# EAGLE design dual.seq.v1.0.1.main (EAGLE 7.7.0)
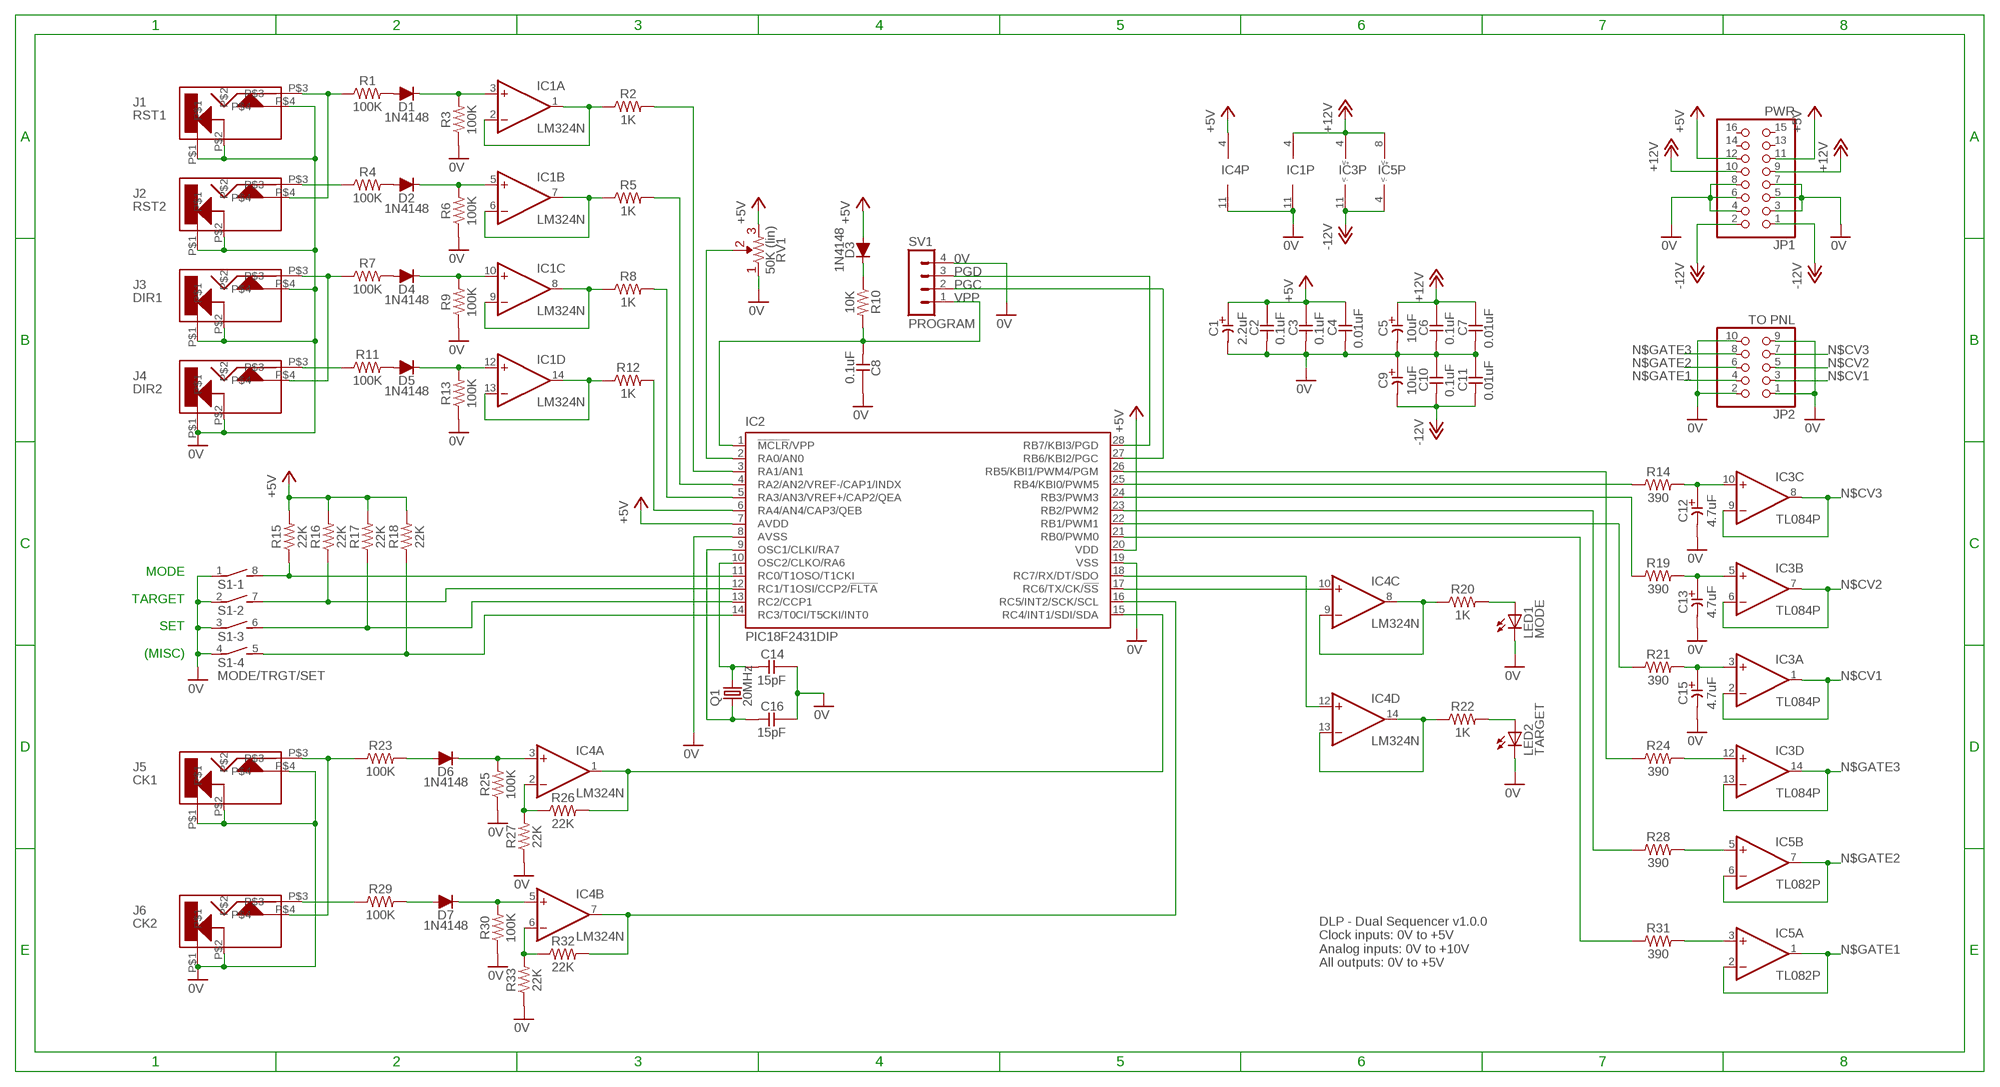
[diagram p0: schematic, sheet 1]

## Parts
C1  2.2uF  CE-USE2-5  [E2-5]
C2  0.1uF  CC-US025-024X044  [C025-024X044]
C3  0.1uF  CC-US025-024X044  [C025-024X044]
C4  0.01uF  CC-US025-024X044  [C025-024X044]
C5  10uF  CE-USE2-5  [E2-5]
C6  0.1uF  CC-US025-024X044  [C025-024X044]
C7  0.01uF  CC-US025-024X044  [C025-024X044]
C8  0.1uF  CC-US025-024X044  [C025-024X044]
C9  10uF  CE-USE2-5  [E2-5]
C10  0.1uF  CC-US025-024X044  [C025-024X044]
C11  0.01uF  CC-US025-024X044  [C025-024X044]
C12  4.7uF  CE-USE2-5  [E2-5]
C13  4.7uF  CE-USE2-5  [E2-5]
C14  15pF  CC-US025-024X044  [C025-024X044]
C15  4.7uF  CE-USE2-5  [E2-5]
C16  15pF  CC-US025-024X044  [C025-024X044]
D1  1N4148  [DO34-5]
D2  1N4148  [DO34-5]
D3  1N4148  [DO34-5]
D4  1N4148  [DO34-5]
D5  1N4148  [DO34-5]
D6  1N4148  [DO34-5]
D7  1N4148  [DO34-5]
IC1  LM324N  [DIL14]
IC2  PIC18F2431DIP  [DIL28-3]
IC3  TL084P  [DIL14]
IC4  LM324N  [DIL14]
IC5  TL082P  [DIL08]
J1  RST1  CL1384  [CL1384]
J2  RST2  CL1384  [CL1384]
J3  DIR1  CL1384  [CL1384]
J4  DIR2  CL1384  [CL1384]
J5  CK1  CL1384  [CL1384]
J6  CK2  CL1384  [CL1384]
JP1  PWR  PINHD-2X8  [2X08]
JP2  TO PNL  PINHD-2X5  [2X05]
LED1  MODE  LED3MM  [LED3MM]
LED2  TARGET  LED3MM  [LED3MM]
Q1  20MHz  CRYSTALHC49S  [HC49/S]
R1  100K  R  [0207/7]
R2  1K  R  [0207/7]
R3  100K  R  [0207/7]
R4  100K  R  [0207/7]
R5  1K  R  [0207/7]
R6  100K  R  [0207/7]
R7  100K  R  [0207/7]
R8  1K  R  [0207/7]
R9  100K  R  [0207/7]
R10  10K  R  [0207/7]
R11  100K  R  [0207/7]
R12  1K  R  [0207/7]
R13  100K  R  [0207/7]
R14  390  R  [0207/7]
R15  22K  R  [0207/7]
R16  22K  R  [0207/7]
R17  22K  R  [0207/7]
R18  22K  R  [0207/7]
R19  390  R  [0207/7]
R20  1K  R  [0207/7]
R21  390  R  [0207/7]
R22  1K  R  [0207/7]
R23  100K  R  [0207/7]
R24  390  R  [0207/7]
R25  100K  R  [0207/7]
R26  22K  R  [0207/7]
R27  22K  R  [0207/7]
R28  390  R  [0207/7]
R29  100K  R  [0207/7]
R30  100K  R  [0207/7]
R31  390  R  [0207/7]
R32  22K  R  [0207/7]
R33  22K  R  [0207/7]
RV1  50K (lin)  R-VAR  [R-VAR]
S1  MODE/TRGT/SET  DIP04S  [DIP04S]
SV1  PROGRAM  MA04-1  [MA04-1]

## Nets
0V [PWR]: C1.- C2.2 C3.2 C4.2 C5.- C6.2 C7.2 C8.1 C9.+ C10.1 C11.1 C12.- C13.- C14.1 C15.- C16.1 IC1.11(P:V-) IC2.8(AVSS) IC2.19(VSS) IC4.11(P:V-) J1.P$1 J1.P$2 J1.P$4 J2.P$1 J2.P$2 J3.P$1 J3.P$2 J3.P$4 J4.P$1 J4.P$2 J5.P$1 J5.P$2 J5.P$4 J6.P$1 J6.P$2 JP1.3 JP1.4 JP1.5 JP1.6 JP1.7 JP1.8 JP2.1 JP2.2 JP2.9 JP2.10 LED1.K(C) LED2.K(C) R3.1 R6.1 R9.1 R13.1 R25.1 R27.1 R30.1 R33.1 RV1.R1 S1.1 S1.2 S1.3 S1.4 SV1.4
+5V [PWR]: C1.+ C2.1 C3.1 C4.1 D3.A IC2.7(AVDD) IC2.20(VDD) IC4.4(P:V+) JP1.11 JP1.12 R15.2 R16.2 R17.2 R18.2 RV1.R2
+12V [PWR]: C5.+ C6.1 C7.1 IC1.4(P:V+) IC3.4(P:V+) IC5.8(P:V+) JP1.9 JP1.10
-12V [PWR]: C9.- C10.2 C11.2 IC3.11(P:V-) IC5.4(P:V-) JP1.1 JP1.2
CV3: C12.+ IC3.10(C:+IN) R14.2
N$1: D3.C R10.1
N$2: IC5.3(A:+IN) R31.2
N$3: IC5.5(B:+IN) R28.2
N$4: IC3.12(D:+IN) R24.2
N$5: C15.+ IC3.3(A:+IN) R21.2
N$6: C14.2 IC2.10(OSC2/CLKO/RA6) Q1.2
N$7: C13.+ IC3.5(B:+IN) R19.2
N$8: IC2.26(RB5/KBI1/PWM4/PGM) R24.1
N$9: IC2.23(RB2/PWM2) R28.1
N$10: IC2.21(RB0/PWM0) R31.1
N$11: D5.A R11.2
N$12: IC2.2(RA0/AN0) RV1.VAR
N$13: J1.P$3 J2.P$4 R1.1
N$14: IC2.3(RA1/AN1) R2.2
N$15: D2.A R4.2
N$16: IC2.25(RB4/KBI0/PWM5) R14.1
N$17: IC2.24(RB3/PWM3) R19.1
N$18: IC2.22(RB1/PWM1) R21.1
N$19: IC2.15(RC4/INT1/SDI/SDA) IC4.1(A:OUT) R26.2
N$20: IC2.11(RC0/T1OSO/T1CKI) R15.1 S1.8
N$21: IC2.16(RC5/INT2/SCK/SCL) IC4.7(B:OUT) R32.2
N$22: D5.C IC1.12(D:+IN) R13.2
N$23: J3.P$3 J4.P$4 R7.1
N$24: D4.C IC1.10(C:+IN) R9.2
N$25: IC2.4(RA2/AN2/VREF-/CAP1/INDX) R5.2
N$26: IC2.5(RA3/AN3/VREF+/CAP2/QEA) R8.2
N$27: C16.2 IC2.9(OSC1/CLKI/RA7) Q1.1
N$28: IC2.12(RC1/T1OSI/CCP2/!FLTA) R16.1 S1.7
N$29: IC2.13(RC2/CCP1) R17.1 S1.6
N$30: J5.P$3 J6.P$4 R23.1
N$31: IC2.6(RA4/AN4/CAP3/QEB) R12.2
N$32: D6.C IC4.3(A:+IN) R25.2
N$33: D2.C IC1.5(B:+IN) R6.2
N$34: IC4.13(D:-IN) IC4.14(D:OUT) R22.1
N$35: IC4.8(C:OUT) IC4.9(C:-IN) R20.1
N$36: IC2.17(RC6/TX/CK/!SS) IC4.10(C:+IN)
N$37: IC2.18(RC7/RX/DT/SDO) IC4.12(D:+IN)
N$38: LED1.A R20.2
N$39: LED2.A R22.2
N$40: D1.C IC1.3(A:+IN) R3.2
N$41: J6.P$3 R29.1
N$42: D7.C IC4.5(B:+IN) R30.2
N$43: IC2.14(RC3/T0CI/T5CKI/INT0) R18.1 S1.5
N$44: D6.A R23.2
N$45: D7.A R29.2
N$46: D4.A R7.2
N$47: D1.A R1.2
N$48: J4.P$3 R11.1
N$49: J2.P$3 R4.1
N$50: IC1.1(A:OUT) IC1.2(A:-IN) R2.1
N$51: IC1.6(B:-IN) IC1.7(B:OUT) R5.1
N$52: IC1.8(C:OUT) IC1.9(C:-IN) R8.1
N$53: IC1.13(D:-IN) IC1.14(D:OUT) R12.1
N$54: IC4.2(A:-IN) R26.1 R27.2
N$55: IC4.6(B:-IN) R32.1 R33.2
N$CV1: IC3.1(A:OUT) IC3.2(A:-IN) JP2.3
N$CV2: IC3.6(B:-IN) IC3.7(B:OUT) JP2.5
N$CV3: IC3.8(C:OUT) IC3.9(C:-IN) JP2.7
N$GATE1: IC5.1(A:OUT) IC5.2(A:-IN) JP2.4
N$GATE2: IC5.6(B:-IN) IC5.7(B:OUT) JP2.6
N$GATE3: IC3.13(D:-IN) IC3.14(D:OUT) JP2.8
PGC: IC2.27(RB6/KBI2/PGC) SV1.2
PGD: IC2.28(RB7/KBI3/PGD) SV1.3
VPP: C8.2 IC2.1(!MCLR!/VPP) R10.2 SV1.1
Unconnected: JP1.13 JP1.14 JP1.15 JP1.16

## Notes on the sheet
- MODE
  
  TARGET
  
  SET
  
  (MISC)
- DLP - Dual Sequencer v1.0.0
  Clock inputs: 0V to +5V
  Analog inputs: 0V to +10V
  All outputs: 0V to +5V

## Library data of the parts
C1 C5 C9 C12 C13 C15 = _common:CE-US: ELECTROLYTIC CAPACITOR, US symbol
C2-C4 C6-C8 C10 C11 C14 C16 = _common:CC-US: CAPACITOR, US symbol
D1-D7 = _common:1N4148: DIODE high speed (Philips)
IC1 IC4 = linear:LM324: OP AMP
IC2 = _common:PIC18F2*31: USB Microcontrollers with nanoWatt Technology High-Performance, Enhanced Flash, 28-Pin, Source: http://ww1.microchip.com/downloads/en/devicedoc/39616d.pdf; MF: MICROCHIP; MPN: PIC18F2431-I/SP
IC3 = _common:TL084: OP AMP
IC5 = _common:TL082: OP AMP
J1-J6 = jacks:CL1384
JP1 = pinhead:PINHD-2X8: PIN HEADER
JP2 = pinhead:PINHD-2X5: PIN HEADER
LED1 LED2 = led:LED: LED OSRAM: - CHIPLED LG R971, LG N971, LY N971, LG Q971, LY Q971, LO R971, LY R971 LH N974, LH R974 LS Q976, LO Q976, LY Q976 LO Q996 - Hyper CHIPLED LW Q18S LB Q993, LB Q99A, LB R99A - SideLED LS A670, LO A670, LY A670, LG A670, LP A670 LB A673, LV A673, LT A673, LW A673 LH A674 LY A675 LS A676, LA A676, LO A676, LY A676, LW A676 LS A679, LY A679, LG A679 - Hyper Micro SIDELED® LS Y876, LA Y876, LO Y876, LY Y876 LT Y87S - SmartLED LW L88C, LW L88S LB L89C, LB L89S, LG L890 LS L89K, LO L89K, LY L89K LS L896, LA L896, LO L896, LY L896 - TOPLED LS T670, LO T670, LY T670, LG T670, LP T670 LSG T670, LSP T670, LSY T670, LOP T670, LYG T670 LG T671, LOG T671, LSG T671 LB T673, LV T673, LT T673, LW T673 LH T674 LS T676, LA T676, LO T676, LY T676, LB T676, LH T676, LSB T676, LW T676 LB T67C, LV T67C, LT T67C, LS T67K, LO T67K, LY T67K, LW E67C LS E67B, LA E67B, LO E67B, LY E67B, LB E67C, LV E67C, LT E67C LW T67C LS T679, LY T679, LG T679 LS T770, LO T770, LY T770, LG T770, LP T770 LB T773, LV T773, LT T773, LW T773 LH T774 LS E675, LA E675, LY E675, LS T675 LS T776, LA T776, LO T776, LY T776, LB T776 LHGB T686 LT T68C, LB T68C - Hyper Mini TOPLED® LB M676 - Mini TOPLED Santana® LG M470 LS M47K, LO M47K, LY M47K Source: http://www.osram.convergy.de LUXEON: - LUMILED® LXK2-PW12-R00, LXK2-PW12-S00, LXK2-PW14-U00, LXK2-PW14-V00 LXK2-PM12-R00, LXK2-PM12-S00, LXK2-PM14-U00 LXK2-PE12-Q00, LXK2-PE12-R00, LXK2-PE12-S00, LXK2-PE14-T00, LXK2-PE14-U00 LXK2-PB12-K00, LXK2-PB12-L00, LXK2-PB12-M00, LXK2-PB14-N00, LXK2-PB14-P00, LXK2-PB14-Q00 LXK2-PR12-L00, LXK2-PR12-M00, LXK2-PR14-Q00, LXK2-PR14-R00 LXK2-PD12-Q00, LXK2-PD12-R00, LXK2-PD12-S00 LXK2-PH12-R00, LXK2-PH12-S00 LXK2-PL12-P00, LXK2-PL12-Q00, LXK2-PL12-R00 Source: www.luxeon.com KINGBRIGHT: KA-3528ASYC Source: www.kingbright.com
Q1 = crystal:CRYSTAL: CRYSTAL; OC_FARNELL: 1667008; OC_NEWARK: unknown
R1-R33 = _common:R: RESISTOR, US symbol
RV1 = _common:R-VAR
S1 = switch-dil:DIP04S: DIL/CODE SWITCH; OC_FARNELL: unknown; OC_NEWARK: unknown
SV1 = con-lstb:MA04-1: PIN HEADER; OC_FARNELL: unknown; OC_NEWARK: unknown

## Net classes
1 PWR: width 0.508 mm

## Board
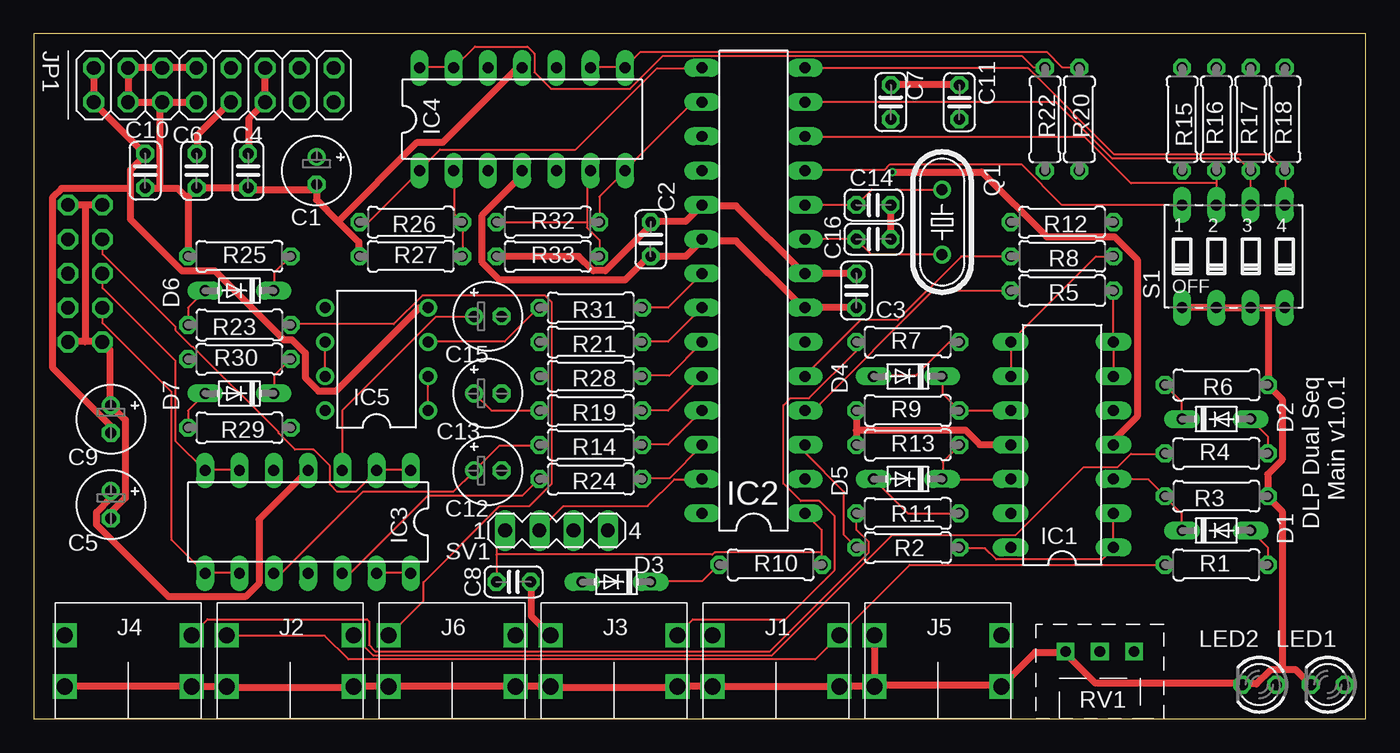
[diagram p1: board, top side]
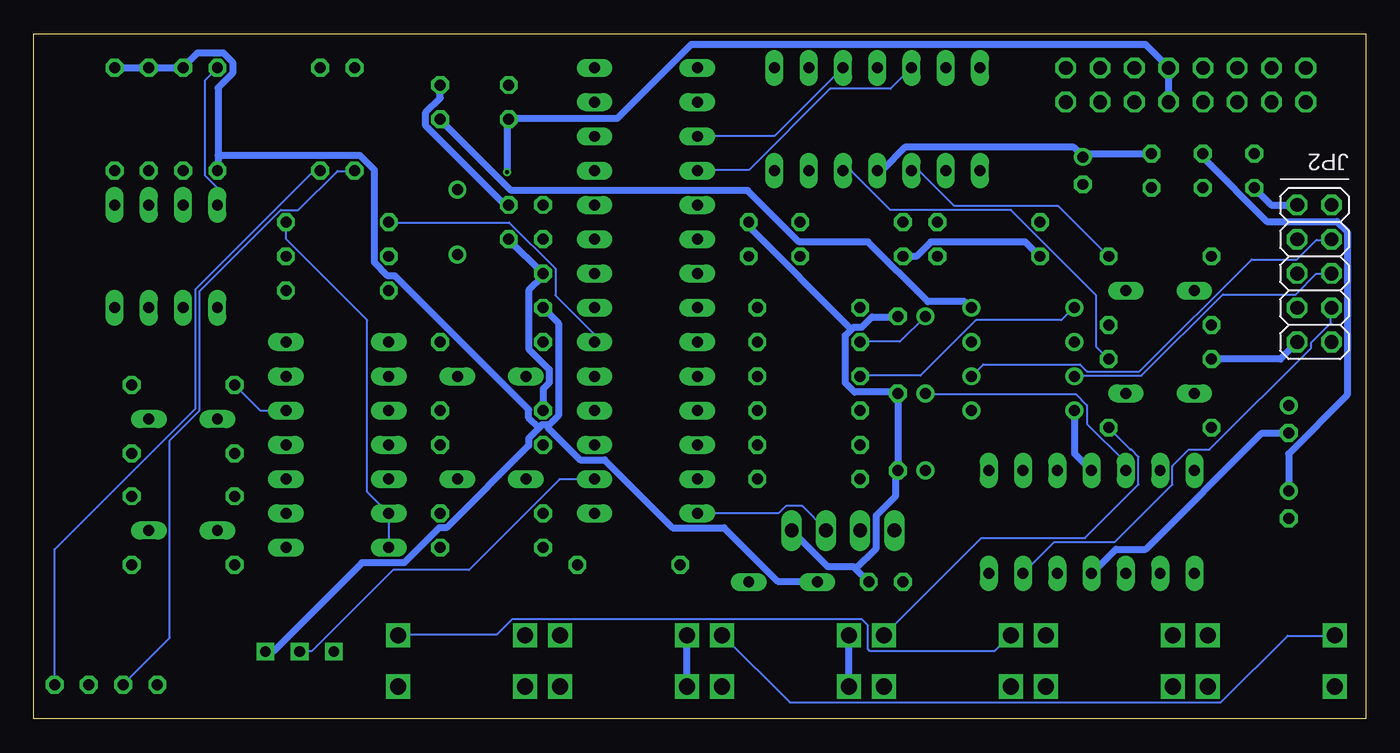
[diagram p2: board, bottom side, seen from below]

Size 98.7 x 50.79 mm. Coordinates in mm from the lower left corner, seen from the top.
Outline: 0,0 98.7,0 98.7,50.79 0,50.79 0,0
Copper layers (1*16): Top 0.035mm / dielectric 1.5mm / Bottom 0.035mm
Design rules "SeeedStudio_2layer_DRU_no_angle_20140221": minimum track width 6mil, minimum drill 12mil, track to track 6mil, track to pad 6mil, pad to pad 6mil, via to via 6mil, smd to smd 0mil, copper to edge 10mil, drill to drill 10mil, minimum pad ring 10mil, minimum via ring 6mil, stop-mask expansion 2mil, vias tented up to drill 100mil, thermal gap 10mil

### Footprints (pad centres in the part's own frame; a part is rotated, then mirrored left to right if it is on the bottom)
E2-5 = drill 0.813 pad 1.27: + -1.016,0 | drill 0.813 pad 1.27 octagon: - 1.016,0
C025-024X044 = drill 0.813 octagon: 1 -1.27,0; 2 1.27,0
DO34-5 = drill 0.813 long: A 2.54,0; C -2.54,0
DIL14 = drill 0.813 long: 1 -7.62,-3.81; 2 -5.08,-3.81; 3 -2.54,-3.81; 4 0,-3.81; 5 2.54,-3.81; 6 5.08,-3.81; 7 7.62,-3.81; 8 7.62,3.81; 9 5.08,3.81; 10 2.54,3.81; 11 0,3.81; 12 -2.54,3.81; 13 -5.08,3.81; 14 -7.62,3.81
DIL28-3 = drill 0.813 long: 1 -16.51,-3.81; 2 -13.97,-3.81; 3 -11.43,-3.81; 4 -8.89,-3.81; 5 -6.35,-3.81; 6 -3.81,-3.81; 7 -1.27,-3.81; 8 1.27,-3.81; 9 3.81,-3.81; 10 6.35,-3.81; 11 8.89,-3.81; 12 11.43,-3.81; 13 13.97,-3.81; 14 16.51,-3.81; 15 16.51,3.81; 16 13.97,3.81; 17 11.43,3.81; 18 8.89,3.81; 19 6.35,3.81; 20 3.81,3.81; 21 1.27,3.81; 22 -1.27,3.81; 23 -3.81,3.81; 24 -6.35,3.81; 25 -8.89,3.81; 26 -11.43,3.81; 27 -13.97,3.81; 28 -16.51,3.81
DIL08 = drill 0.813 pad 1.27: 1 -3.81,-3.81; 2 -1.27,-3.81; 3 1.27,-3.81; 4 3.81,-3.81; 5 3.81,3.81; 6 1.27,3.81; 7 -1.27,3.81; 8 -3.81,3.81
CL1384 = drill 1.2 square: P$1 0,0; P$2 9.4,0; P$3 0,-3.8; P$4 9.4,-3.8
2X08 = drill 1.016 octagon: 1 -8.89,-1.27; 2 -8.89,1.27; 3 -6.35,-1.27; 4 -6.35,1.27; 5 -3.81,-1.27; 6 -3.81,1.27; 7 -1.27,-1.27; 8 -1.27,1.27; 9 1.27,-1.27; 10 1.27,1.27; 11 3.81,-1.27; 12 3.81,1.27; 13 6.35,-1.27; 14 6.35,1.27; 15 8.89,-1.27; 16 8.89,1.27
2X05 = drill 1.016 octagon: 1 -5.08,-1.27; 2 -5.08,1.27; 3 -2.54,-1.27; 4 -2.54,1.27; 5 0,-1.27; 6 0,1.27; 7 2.54,-1.27; 8 2.54,1.27; 9 5.08,-1.27; 10 5.08,1.27
LED3MM = drill 0.813 octagon: A -1.27,0; K 1.27,0
HC49/S = drill 0.813: 1 -2.413,0; 2 2.413,0
0207/7 = drill 0.813 octagon: 1 -3.81,0; 2 3.81,0
R-VAR = drill 0.8 square: R1 -2.54,0; R2 2.54,0; VAR 0,0
DIP04S = drill 0.813 long: 1 -3.81,-3.81; 2 -1.27,-3.81; 3 1.27,-3.81; 4 3.81,-3.81; 5 3.81,3.81; 6 1.27,3.81; 7 -1.27,3.81; 8 -3.81,3.81
MA04-1 = drill 1.016 long: 1 -3.81,0; 2 -1.27,0; 3 1.27,0; 4 3.81,0

### Placement (x,y rotation side)
C1  20.95,40.64 270 top
C2  45.72,35.56 90 top
C3  60.96,31.75 90 top
C4  15.88,40.64 270 top
C5  5.71,15.88 270 top
C6  12.06,40.64 270 top
C7  63.5,45.72 90 top
C8  35.56,10.16 180 top
C9  5.71,22.23 270 top
C10  8.26,40.64 90 top
C11  68.58,45.72 270 top
C12  33.66,18.41 0 top
C13  33.66,24.13 0 top
C14  62.23,38.1 180 top
C15  33.66,29.84 0 top
C16  62.23,35.56 180 top
D1  87.63,13.97 0 top
D2  87.63,22.23 0 top
D3  43.18,10.16 180 top
D4  64.77,25.4 180 top
D5  64.77,17.78 180 top
D6  15.24,31.75 180 top
D7  15.24,24.13 180 top
IC1  76.2,20.32 90 top
IC2  53.34,31.75 90 top
IC3  20.32,14.61 180 top
IC4  36.2,44.45 0 top
IC5  25.4,26.67 90 top
J1  59.7,2.4 180 top
J2  23.7,2.4 180 top
J3  47.7,2.4 180 top
J4  11.7,2.4 180 top
J5  71.7,2.4 180 top
J6  35.7,2.4 180 top
JP1  13.34,46.99 0 top
JP2  3.81,33.02 270 bottom
LED1  95.89,2.54 180 top
LED2  90.81,2.54 180 top
Q1  67.31,36.83 90 top
R1  87.63,11.43 0 top
R2  64.77,12.7 180 top
R3  87.63,16.51 180 top
R4  87.63,19.68 0 top
R5  76.2,31.75 180 top
R6  87.63,24.77 180 top
R7  64.77,27.94 0 top
R8  76.2,34.29 180 top
R9  64.77,22.86 0 top
R10  54.61,11.43 0 top
R11  64.77,15.24 0 top
R12  76.2,36.83 180 top
R13  64.77,20.32 0 top
R14  41.27,20.32 180 top
R15  85.09,44.45 270 top
R16  87.63,44.45 90 top
R17  90.17,44.45 90 top
R18  92.71,44.45 90 top
R19  41.27,22.86 180 top
R20  77.47,44.45 270 top
R21  41.27,27.94 180 top
R22  74.93,44.45 270 top
R23  15.24,29.21 180 top
R24  41.27,17.78 180 top
R25  15.24,34.29 0 top
R26  27.94,36.83 180 top
R27  27.94,34.29 0 top
R28  41.27,25.4 180 top
R29  15.24,21.59 180 top
R30  15.24,26.67 0 top
R31  41.27,30.48 180 top
R32  38.1,36.83 0 top
R33  38.1,34.29 0 top
RV1  79,5 0 top
S1  88.9,34.29 0 top
SV1  38.73,13.97 0 top

### Tracks (layer width: path | path; a pad name or v marks a point on that pad's centre or on a via)
0V
  Top 0.508: 22.55,36.88 20.95,38.48 C1.- 20.73,39.24 16.08,39.24 C4.2 15.85,39.4 12.27,39.4 C6.2 12.04,39.32 11.43,38.71 | 22.55,36.88 24.08,35.36 24.08,34.29 R27.1 | 22.55,36.88 28.42,42.75 30.33,42.75 35.81,48.23 36.2,48.23 IC4.11 | C5.- 5.71,15.32 6.78,16.38 6.78,22.17 C9.+ 5.64,23.47 5.64,27.36 5.26,27.74 JP2.9 5.03,27.96 3.81,27.96 | 3.81,27.96 2.59,27.96 JP2.10 | JP1.5 JP1.3 7.01,45.72 7.01,48.23 JP1.4 7.24,48.31 9.53,48.31 JP1.6 9.75,48.31 12.04,48.31 JP1.8 | JP1.5 JP1.7 | JP2.1 3.81,38.1 | 3.81,38.1 JP2.2 | 11.43,38.71 R25.1 | 9.37,39.32 10.67,39.32 11.2,38.79 11.43,38.71 | 9.37,39.32 8.31,39.32 C10.1 | 9.37,39.32 9.37,45.49 JP1.5 | 3.81,38.1 3.81,27.96 | R9.1 60.96,21.41 | 60.96,21.41 R13.1 | 60.96,21.41 69.04,21.41 70.1,20.34 72.39,20.34 IC1.11 | C7.2 63.55,47.02 68.58,47.02 C11.1 | C16.1 63.48,35.59 63.48,38.1 C14.1 | C3.2 60.96,32.99 57.15,32.99 IC2.8 56.92,33.15 52.05,38.02 49.76,38.02 IC2.19 48.31,36.88 45.72,36.88 C2.2 45.57,36.65 45.57,36.42 42.37,33.22 41.45,33.22 40.39,34.29 R33.1 | S1.1 S1.2 S1.3 91.52,30.48 | 91.52,30.48 S1.4 | 92.51,3.66 93.5,3.66 LED1.K | 92.51,3.66 91.67,3.66 90.6,2.59 89.53,2.59 LED2.K 89.31,2.67 78.64,2.67 76.58,4.72 RV1.R1 76.43,4.95 74.22,4.95 71.7,2.44 J5.P$1 71.48,2.52 62.56,2.52 J5.P$2 | 92.51,3.66 92.51,15.39 91.59,16.31 R3.1 91.44,18.14 92.51,19.2 92.51,23.7 R6.1 91.52,24.99 91.52,30.48 | J4.P$2 2.36,2.44 11.66,2.44 J4.P$1 11.89,2.44 14.25,2.44 J2.P$2 14.55,2.36 23.47,2.36 J2.P$1 23.77,2.44 26.29,2.44 J6.P$2 26.52,2.44 35.51,2.44 J6.P$1 35.74,2.44 38.25,2.44 J3.P$2 38.56,2.36 47.47,2.36 J3.P$1 47.7,2.44 50.29,2.44 J1.P$2 50.52,2.44 59.51,2.44 J1.P$1 59.74,2.44 62.26,2.44 J5.P$2
  Top 0.508: J5.P$4 62.33,6.17 62.33,2.67 J5.P$2 | C8.1 36.88,10.13 36.88,7.62 38.25,6.25 J3.P$4
  Bottom 0.508: R33.1 33.3,34.29 32.23,35.36 25.22,35.36 24.16,34.29 R27.1 | R30.1 6.33,26.67 5.11,27.89 JP2.9 | JP2.1 7.01,38.1 8.23,39.32 C10.1 | C16.1 63.48,35.51 60.96,32.99 C3.2 61.04,32.77 62.03,31.77 62.03,27.43 60.5,25.91 60.5,24.92 60.96,24.46 R9.1 | C11.1 68.58,46.02 69.65,44.96 69.65,43.97 63.78,38.1 C14.1 | 38.1,28.88 38.56,28.42 38.56,24.92 37.87,24.23 34.9,24.23 C13.- C12.- 34.82,18.21 34.82,16.54 36.27,15.09 36.27,12.65 37.8,11.12 | 38.1,28.88 37.95,29.03 37.34,29.03 36.58,29.79 34.67,29.79 C15.- | J1.P$4 50.29,6.17 50.29,2.44 J1.P$2 | SV1.4 39.85,11.28 37.95,11.28 37.8,11.12 | C8.1 37.8,11.12 | J3.P$2 38.33,2.44 38.33,6.17 J3.P$4 | C2.2 45.72,36.5 38.1,28.88
+5V
  Top 0.508: C4.1 15.93,41.91 15.93,44.5 JP1.11 JP1.12 | C3.1 IC2.7 56.92,30.56 52.05,35.43 49.76,35.43 IC2.20 49.53,35.51 48.31,34.29 C2.1 45.49,34.21 43.81,32.54 34.52,32.54 33.22,33.83 33.22,37.34 36.2,40.31 IC4.4
  Bottom 0.508: IC4.4 36.2,40.69 35.81,40.69 34.14,42.37 21.64,42.37 20.95,41.68 C1.+ 20.73,41.76 20.57,41.91 C4.1 | 85.04,41.76 85.04,46.79 83.97,47.85 83.97,48.69 84.66,49.38 86.56,49.38 87.63,48.31 R16.2 87.86,48.23 90.14,48.23 R17.2 90.37,48.23 92.66,48.23 R18.2 | 85.04,41.76 85.04,40.69 R15.2 | 61.27,21.57 61.04,21.79 60.58,21.79 | 61.27,21.57 62.03,20.8 62.03,20.27 68.12,14.17 68.66,14.17 71.25,11.58 74.37,11.58 80.92,5.03 81.53,5.03 RV1.R2 | 60.58,21.79 60.5,21.79 59.82,22.48 59.82,29.34 C3.1 | D3.A 40.69,10.21 43.59,10.21 47.55,14.17 51.36,14.17 56.39,19.2 58.22,19.2 60.58,21.57 60.58,21.79 | 85.04,41.76 74.52,41.76 73.46,40.69 73.46,33.83 72.47,32.84 71.93,32.84 62.03,22.94 62.03,22.33 61.27,21.57
+12V  (via drill 0.3)
  Top 0.508: C5.+ 5.71,16.38 4.65,15.32 4.65,14.4 9.98,9.07 15.7,9.07 16.69,10.06 16.69,14.78 IC3.4 | C6.1 12.12,41.91 12.12,43.28 14.55,45.72 JP1.9 | IC1.4 80.01,20.65 81.76,22.4 81.76,34.06 80.09,35.74 75.06,35.74 70.26,40.54 v63.63,40.54
  Bottom 0.508: IC3.4 21.57,19.66 21.57,22.86 IC5.8 | v63.63,40.54 63.63,44.27 C7.1 63.48,44.5 55.47,44.5 49.99,49.99 16.31,49.99 14.63,48.31 JP1.10 14.63,48.01 14.63,45.72 JP1.9 | C5.+ 5.71,19.66 1.37,24 1.37,36.12 2.13,36.88 7.32,36.88 12.04,41.6 12.04,41.91 C6.1
-12V
  Top 0.508: IC5.4 28.57,30.48 22.4,24.31 21.11,24.31 20.12,25.3 20.12,27.13 19.13,28.12 18.52,28.12 13.41,33.22 10.97,33.22 7.16,37.03 7.16,39.32 | 7.16,39.32 7.16,40.69 8.15,41.68 C10.2 8.23,41.91 4.42,45.72 JP1.1 4.5,45.95 4.5,48.23 JP1.2 | C9.- 5.71,21.72 1.37,26.06 1.37,38.63 2.06,39.32 7.16,39.32
  Bottom 0.508: C9.- 5.71,21.18 7.7,21.18 16.31,12.57 18.52,12.57 20.27,10.82 IC3.11 | C11.2 68.58,44.42 63.32,39.17 45.8,39.17 41.99,35.36 36.88,35.36 32.46,30.94 29.72,30.94 29.26,30.48 IC5.4
CV3
  Top 0.152: IC3.10 17.83,10.82 18.36,10.82 24.38,16.84 31.09,16.84 32.61,18.36 C12.+ 32.69,18.44 34.52,20.27 37.41,20.27 R14.2
N$1
  Top 0.152: D3.C 45.72,10.21 49.53,10.21 50.75,11.43 R10.1
N$2
  Top 0.152: IC5.3 29.26,27.96 34.9,27.96 37.41,30.48 R31.2
N$3
  Bottom 0.152: R28.2 37.41,25.45 32.99,25.45 28.88,29.57 22.55,29.57 21.64,30.48 IC5.5
N$4
  Top 0.152: IC3.12 22.86,10.82 23.47,10.82 29.18,16.54 36.2,16.54 37.41,17.75 R24.2
N$5
  Top 0.152: IC3.3 22.86,22.86 29.79,29.79 32.61,29.79 C15.+
  Bottom 0.152: C15.+ 34.52,27.96 37.41,27.96 R21.2
N$6
  Top 0.152: IC2.10 C14.2 62.1,39.24 Q1.2
N$7
  Top 0.152: R19.2 33.91,22.86 C13.+
  Bottom 0.152: IC3.5 17.83,18.44 17.83,19.05 20.65,21.87 20.65,23.24 21.49,24.08 32.61,24.08 C13.+
N$8
  Top 0.152: R24.1 45.11,17.83 47.09,17.83 49.53,20.27 IC2.26
N$9
  Top 0.152: R28.1 45.11,25.45 47.09,25.45 49.53,27.89 IC2.23
N$10
  Top 0.152: R31.1 47.02,30.48 49.53,32.99 IC2.21
N$11
  Top 0.152: R11.2 64.77,15.24 D5.A
N$12
  Bottom 0.152: RV1.VAR 78.94,5.03 78.11,5.03 72.08,11.05 66.45,11.05 59.74,17.75 57.15,17.75 IC2.2
N$13
  Top 0.152: R1.1 64.92,11.43 59.74,6.25 J1.P$3 59.66,6.17 57.91,4.42 23.32,4.42 21.57,6.17 14.33,6.17 J2.P$4
N$14
  Top 0.152: IC2.3 57.15,19.74 60.05,16.84 60.05,13.64 60.96,12.72 R2.2
N$15
  Top 0.152: R4.2 91.44,20.95 D2.A
N$16
  Top 0.152: IC2.25 47.02,20.34 45.11,20.34 R14.1
N$17
  Top 0.152: R19.1 47.02,22.86 49.53,25.38 IC2.24
N$18
  Top 0.152: IC2.22 47.02,27.96 45.11,27.96 R21.1
N$19
  Top 0.152: R26.2 24.16,36.88 24.84,36.88 28.57,40.62 IC4.1 28.57,40.69 30.1,42.22 40.16,42.22 46.18,48.23 49.53,48.23 IC2.15
N$20
  Top 0.152: S1.8 76.2,38.1 73.23,41.07 63.4,41.07 63.02,40.69 57.15,40.69 IC2.11
  Bottom 0.152: R15.1 86.03,47.32 86.03,40.31 85.11,39.4 85.11,38.1 S1.8
N$21
  Top 0.152: R32.2 41.91,38.71 43.81,40.62 IC4.7 43.81,40.69 48.84,45.72 IC2.16
N$22
  Top 0.152: R13.2 68.58,20.27 67.36,19.05 67.36,17.83 D5.C 67.36,17.75 72.39,17.75 IC1.12
N$23
  Top 0.152: R7.1 60.96,27.28 57.45,23.77 56.08,23.77 55.55,23.24 55.55,17.45 56.84,16.15 58.22,16.15 59.36,15.01 59.36,11.05 55.7,7.39 48.84,7.39 47.7,6.25 J3.P$3
  Bottom 0.152: J4.P$4 2.36,6.17 5.79,6.17 10.74,1.22 42.67,1.22 47.62,6.17 J3.P$3
N$24
  Top 0.152: D4.C 67.36,25.38 67.36,24.08 R9.2 IC1.10
N$25
  Top 0.152: IC2.4 57.76,22.86 66.6,31.7 72.39,31.7 R5.2
N$26
  Top 0.152: R8.2 68.73,34.29 64.01,29.57 61.27,29.57 57.15,25.45 IC2.5
N$27
  Top 0.152: IC2.9 57.15,35.59 60.96,35.59 C16.2 60.96,35.51 62.03,34.44 67.28,34.44 Q1.1
N$28
  Top 0.152: R16.1 87.63,39.7 | 87.63,39.7 S1.7 | 87.63,39.7 81.31,39.7 77.88,43.13 57.15,43.13 IC2.12
N$29
  Top 0.152: S1.6 90.14,38.1 90.14,40.62 R17.1 90.14,40.69 89.31,41.53 79.93,41.53 75.74,45.72 IC2.13
N$30
  Top 0.152: R23.1 19.05,29.26 26.67,29.26 28.8,31.39 37.87,31.39 38.41,30.86 38.41,17.45 36.73,15.77 34.52,15.77 28.88,10.13 28.88,8.76 26.36,6.25 J6.P$4
  Bottom 0.152: J5.P$3 71.63,6.25 64.39,6.25 63.25,7.39 37.34,7.39 36.88,6.93 36.88,5.18 36.73,5.03 27.51,5.03 26.36,6.17 J6.P$4
N$31
  Bottom 0.152: IC2.6 57.15,28.5 60.05,31.39 60.05,33.38 63.48,36.8 72.39,36.8 R12.2
N$32
  Top 0.152: R25.2 17.83,33.07 17.83,31.77 D6.C
  Bottom 0.152: R25.2 22.78,38.02 30.48,38.02 33.07,40.62 33.6,40.62 IC4.3
N$33
  Top 0.152: R6.2 85.04,23.55 85.04,22.25 D2.C
  Bottom 0.152: IC1.5 81.92,22.86 R6.2
N$34
  Top 0.152: IC4.14 28.57,48.31 31.09,48.31 IC4.13 32.69,49.84 36.58,49.84 37.11,49.3 37.11,47.93 38.33,46.71 44.2,46.71 46.63,49.15 73.23,49.15 74.07,48.31 74.91,48.31 R22.1
N$35
  Top 0.152: 43.81,48.31 41.3,48.31 IC4.9 | 43.81,48.31 44.96,49.45 75.06,49.45 76.2,48.31 77.42,48.31 R20.1 | 43.81,48.31 IC4.8
N$36
  Bottom 0.152: IC2.17 49.53,43.2 43.81,43.2 38.79,48.23 IC4.10
N$37
  Bottom 0.152: IC4.12 35.2,46.71 39.7,46.71 45.72,40.69 49.53,40.69 IC2.18
N$38
  Bottom 0.152: LED1.A 97.16,12.57 86.72,23.01 86.72,31.85 77.95,40.62 77.5,40.62 R20.2
N$39
  Bottom 0.152: R22.2 74.98,40.62 76.2,40.62 79.1,37.72 80.39,37.72 86.41,31.7 86.41,22.86 88.62,20.65 88.62,6.02 92.05,2.59 LED2.A
N$40
  Top 0.152: D1.C 85.04,14.02 85.04,15.24 83.82,16.46 R3.2 83.82,16.54 82.6,17.75 80.01,17.75 IC1.3
N$41
  Bottom 0.152: R29.1 19.05,21.57 17.45,19.96 17.37,19.96 16.84,19.43 16.84,17.37 20.8,13.41 28.5,13.41 35.66,6.25 J6.P$3
N$42
  Top 0.152: R30.2 17.83,25.45 17.83,24.16 D7.C
  Bottom 0.152: R30.2 19.96,27.58 19.96,31.39 26.29,37.72 35.2,37.72 38.1,40.62 38.71,40.62 IC4.5
N$43
  Top 0.152: S1.5 92.73,38.1 92.73,40.62 R18.1 91.52,41.83 80.09,41.83 73.69,48.23 57.15,48.23 IC2.14
N$44
  Top 0.152: R23.2 11.43,30.48 D6.A
N$45
  Top 0.152: R29.2 11.43,22.86 D7.A
N$46
  Top 0.152: D4.A 62.26,25.45 65.38,25.45 67.82,27.89 68.58,27.89 R7.2
N$47
  Top 0.152: R1.2 91.44,12.72 90.22,13.95 D1.A
N$48
  Top 0.152: R11.1 60.96,14.02 61.87,13.11 61.87,12.34 54.56,5.03 25.3,5.03 24.84,5.49 24.84,7.24 24.69,7.39 12.88,7.39 11.73,6.25 J4.P$3
N$49
  Top 0.152: R4.1 83.82,19.66 81.31,19.66 80.31,18.67 77.8,18.67 72.77,13.64 63.63,13.64 54.71,4.72 25.15,4.72 23.7,6.17 J2.P$3
N$50
  Top 0.152: R2.1 68.58,12.65 70.48,12.65 71.32,11.81 79.17,11.81 80.01,12.65 IC1.1 IC1.2
N$51
  Top 0.152: IC1.6 IC1.7 R5.1
N$52
  Top 0.152: IC1.9 IC1.8 72.39,27.96 78.72,34.29 R8.1
N$53
  Bottom 0.152: IC1.14 IC1.13 73.99,16.84 73.99,29.57 80.01,35.59 R12.1
N$54
  Top 0.152: R27.2 31.77,34.29 31.77,36.8 R26.1 31.17,37.41 31.17,40.62 IC4.2
N$55
  Top 0.152: R33.2 41.91,35.51 41,36.42 41,36.8 | 41,36.8 41,40.39 41.22,40.62 IC4.6 | 41,36.8 34.29,36.8 R32.1
N$CV1
  Top 0.152: IC3.1 27.89,18.44 25.45,18.44 IC3.2 25.38,18.36 23.85,16.84 22.48,16.84 21.95,17.37 21.95,18.75 20.73,19.96 19.36,19.96 18.14,21.18 18.14,21.26 11.81,27.58 11.73,27.58 10.52,28.8 10.52,29.03 5.11,34.44 5.11,35.51 JP2.3
N$CV2
  Top 0.152: IC3.6 15.24,18.44 12.72,18.44 IC3.7 12.65,18.44 10.52,20.57 10.52,26.52 5.11,31.93 5.11,32.99 JP2.5
N$CV3
  Top 0.152: IC3.9 15.24,10.82 12.72,10.82 IC3.8 12.65,10.82 10.21,13.26 10.21,24.23 5.11,29.34 5.11,30.48 JP2.7
N$GATE1
  Top 0.152: IC5.1 29.18,22.86 29.18,25.38 IC5.2
  Bottom 0.152: JP2.4 2.59,35.51 3.66,35.51 5.11,34.06 8.46,34.06 16.76,25.76 20.65,25.76 21.18,26.29 28.35,26.29 29.18,25.45 IC5.2
N$GATE2
  Top 0.152: IC5.7 21.57,25.45 21.57,27.89 IC5.6
  Bottom 0.152: JP2.6 2.59,32.99 3.66,32.99 5.18,31.47 10.59,31.47 16.61,25.45 21.57,25.45 IC5.7
N$GATE3
  Top 0.152: IC3.13 25.45,10.82 27.89,10.82 IC3.14
  Bottom 0.152: IC3.13 23.09,13.11 18.59,13.11 14.33,17.37 14.33,18.75 13.11,19.96 11.58,19.96 4.04,27.51 4.04,27.89 2.59,29.34 2.59,30.48 JP2.8
PGC
  Top 0.152: IC2.27 49.53,17.75 47.47,17.75 45.49,15.77 39.24,15.77 37.49,14.02 SV1.2
PGD
  Bottom 0.152: IC2.28 43.51,15.24 42.98,15.77 41.76,15.77 40.01,14.02 SV1.3
VPP
  Top 0.152: 34.29,12.19 34.29,13.34 SV1.1 | 34.29,12.19 C8.2 | 58.37,12.34 58.37,14.02 IC2.1 | 58.37,12.34 58.37,11.43 R10.2 | 34.29,12.19 50.29,12.19 50.44,12.34 58.37,12.34

### Text on the board
tNames: DLP Dual Seq / Main v1.0.1